# EAGLE design 5 to 3.3 Level Converter (EAGLE 7.5.0)
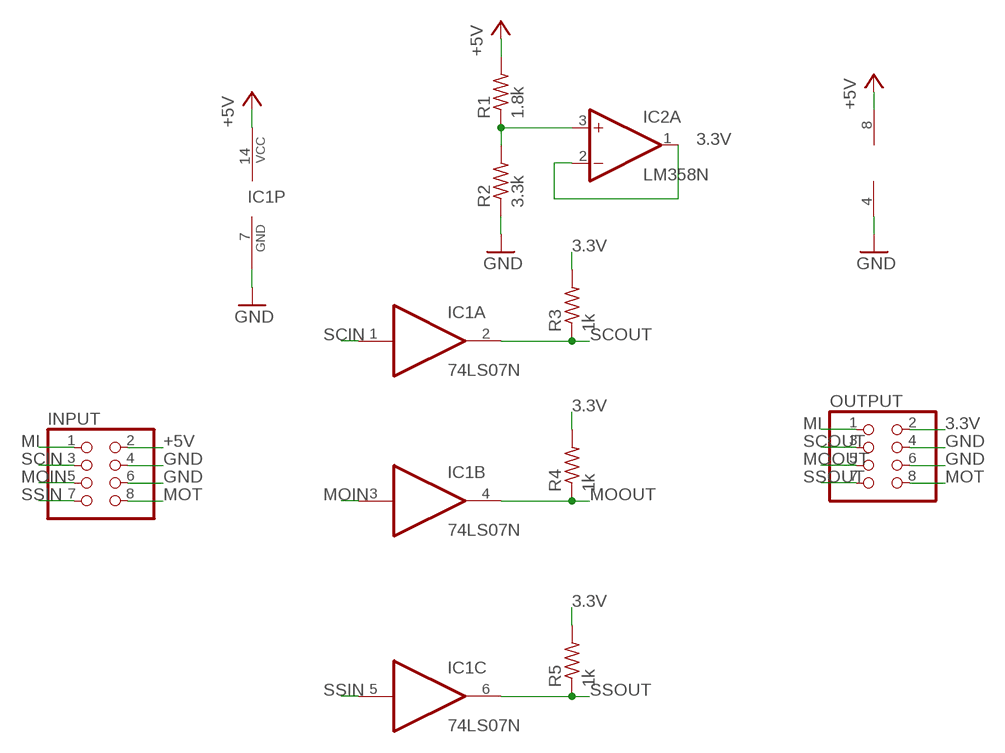
[diagram p0: schematic, sheet 1]

## Parts
IC1  74LS07N  [DIL14]
IC2  LM358N  [DIL08]
INPUT  PINHD-2X4  [2X04]
OUTPUT  PINHD-2X4  [2X04]
R1  1.8k  R-US_0207/7  [0207/7]
R2  3.3k  R-US_0207/7  [0207/7]
R3  1k  R-US_0207/7  [0207/7]
R4  1k  R-US_0207/7  [0207/7]
R5  1k  R-US_0207/7  [0207/7]

## Nets
3.3V: IC2.1(A:OUT) IC2.2(A:-IN) OUTPUT.2 R3.2 R4.2 R5.2
+5V: IC1.14(P:VCC) IC2.8(P:V+) INPUT.2 R1.2
GND: IC1.7(P:GND) IC2.4(P:V-) INPUT.4 INPUT.6 OUTPUT.4 OUTPUT.6 R2.1
MI: INPUT.1 OUTPUT.1
MOIN: IC1.3(B:I) INPUT.5
MOOUT: IC1.4(B:O) OUTPUT.5 R4.1
MOT: INPUT.8 OUTPUT.8
N$1: IC2.3(A:+IN) R1.1 R2.2
SCIN: IC1.1(A:I) INPUT.3
SCOUT: IC1.2(A:O) OUTPUT.3 R3.1
SSIN: IC1.5(C:I) INPUT.7
SSOUT: IC1.6(C:O) OUTPUT.7 R5.1
Unconnected: IC1.8(D:O) IC1.9(D:I) IC1.10(E:O) IC1.11(E:I) IC1.12(F:O) IC1.13(F:I) IC2.5(B:+IN) IC2.6(B:-IN) IC2.7(B:OUT)

## Library data of the parts
IC1 = 74xx-us:74*07: Hex BUFFER, open collector high-voltage output
IC2 = linear:LM358: OP AMP also LM158; LM258; LM2904 Source: http://cache.national.com/ds/LM/LM158.pdf
INPUT OUTPUT = pinhead:PINHD-2X4: PIN HEADER
R1-R5 = rcl:R-US_: RESISTOR, American symbol

## Board
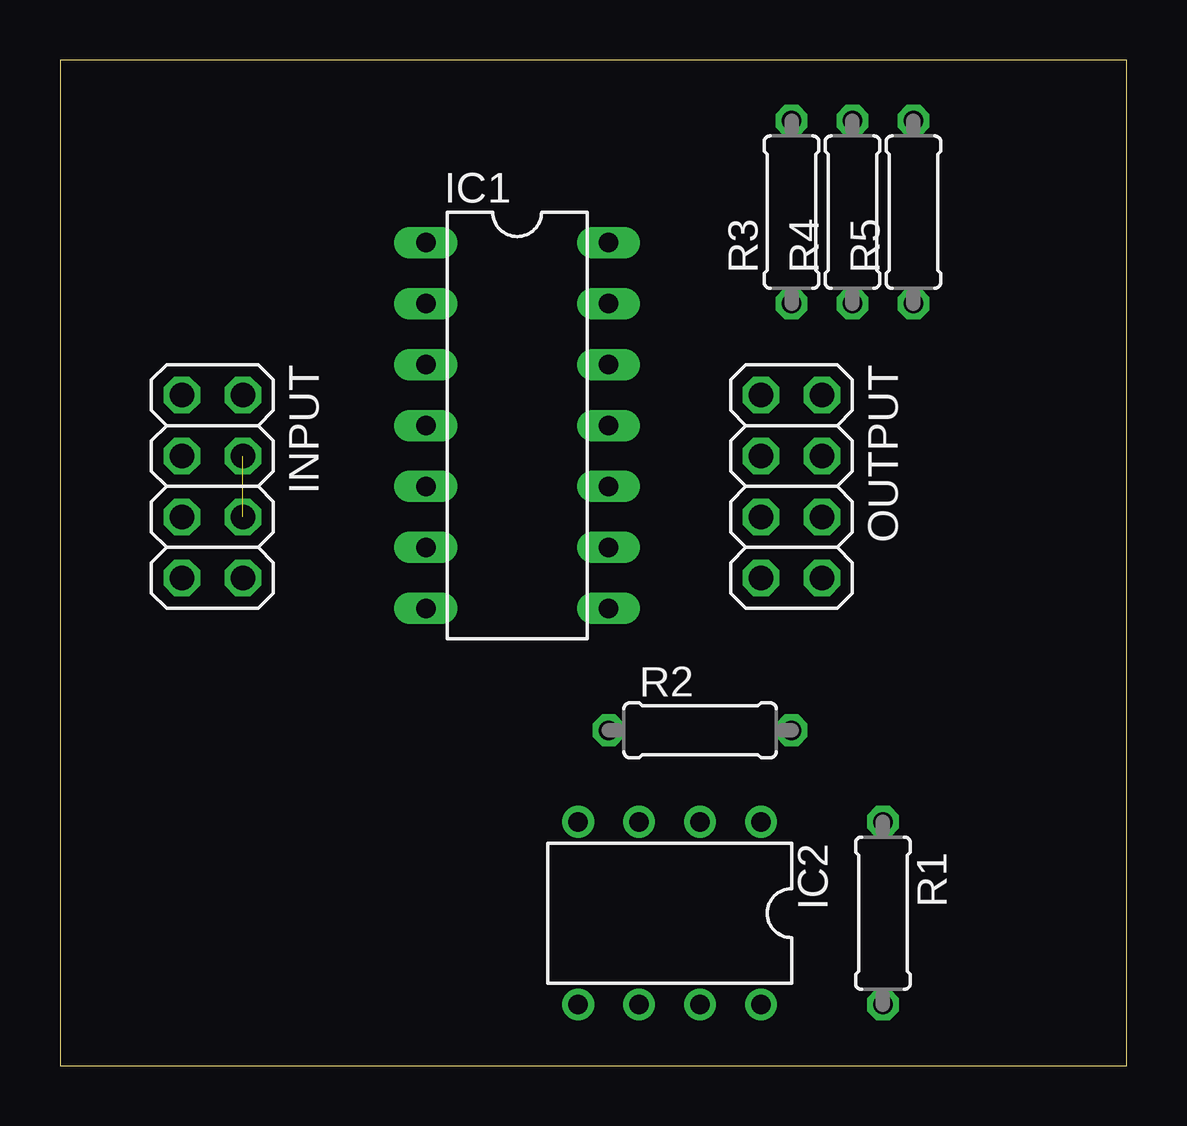
[diagram p1: board, top side]
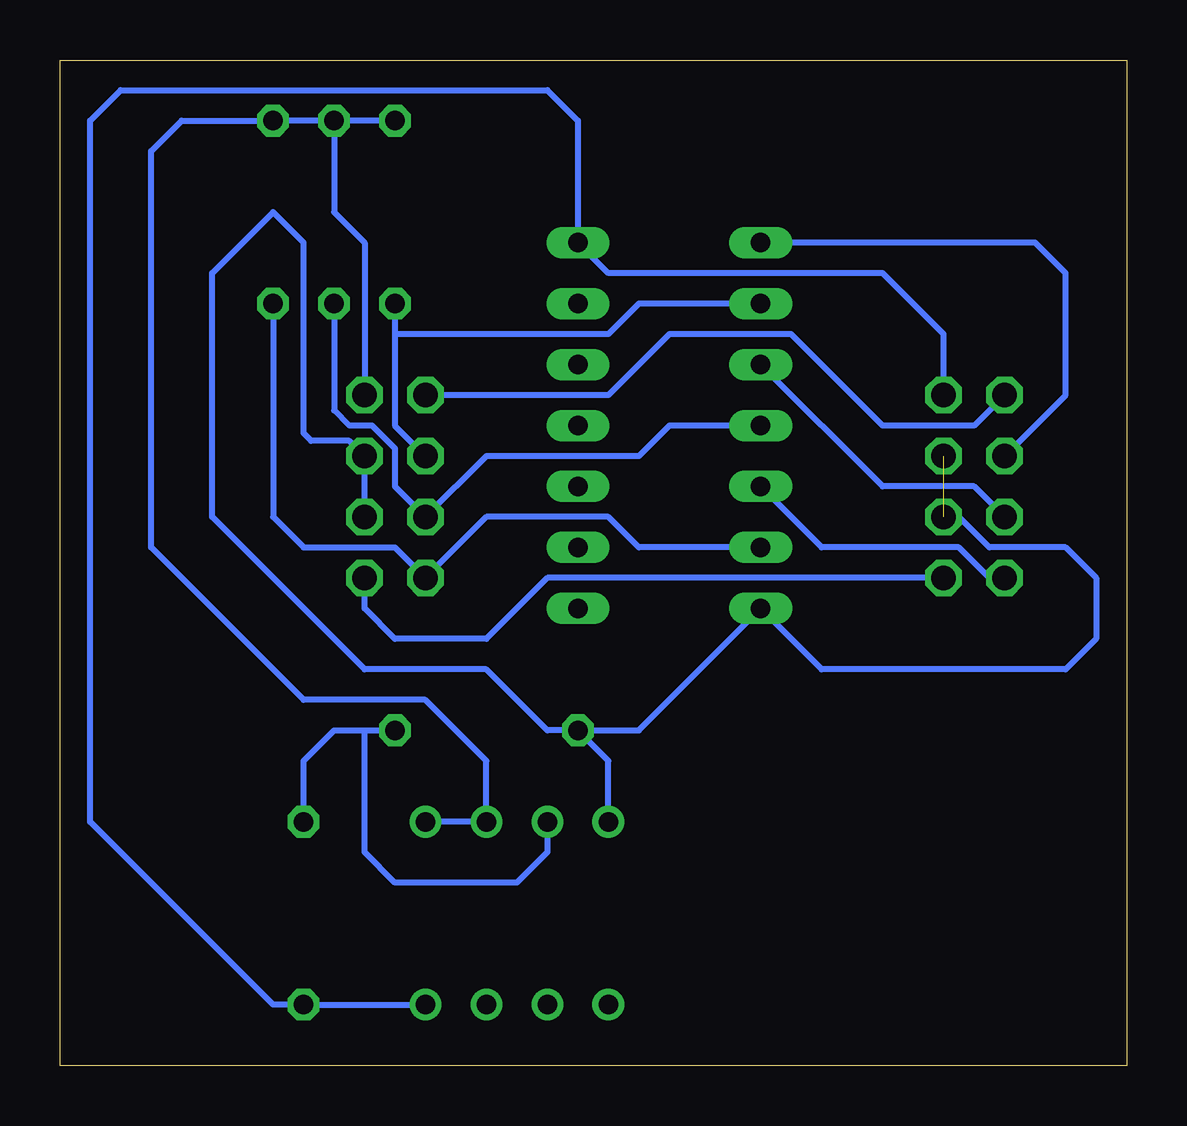
[diagram p2: board, bottom side, seen from below]

Size 44.44 x 41.9 mm. Coordinates in mm from the lower left corner, seen from the top.
Outline: 0,0 44.44,0 44.44,41.9 0,41.9 0,0
Copper layers (1*16): Top 0.035mm / dielectric 1.5mm / Bottom 0.035mm
Design rules "default": minimum track width 10mil, minimum drill 24mil, track to track 8mil, track to pad 8mil, pad to pad 8mil, via to via 8mil, smd to smd 8mil, copper to edge 40mil, drill to drill 8mil, minimum pad ring 10mil, minimum via ring 8mil, stop-mask expansion 4mil, vias tented up to drill 0mil, thermal gap 10mil

### Footprints (pad centres in the part's own frame; a part is rotated, then mirrored left to right if it is on the bottom)
DIL14 = drill 0.813 long: 1 -7.62,-3.81; 2 -5.08,-3.81; 3 -2.54,-3.81; 4 0,-3.81; 5 2.54,-3.81; 6 5.08,-3.81; 7 7.62,-3.81; 8 7.62,3.81; 9 5.08,3.81; 10 2.54,3.81; 11 0,3.81; 12 -2.54,3.81; 13 -5.08,3.81; 14 -7.62,3.81
DIL08 = drill 0.813 pad 1.27: 1 -3.81,-3.81; 2 -1.27,-3.81; 3 1.27,-3.81; 4 3.81,-3.81; 5 3.81,3.81; 6 1.27,3.81; 7 -1.27,3.81; 8 -3.81,3.81
2X04 = drill 1.016 octagon: 1 -3.81,-1.27; 2 -3.81,1.27; 3 -1.27,-1.27; 4 -1.27,1.27; 5 1.27,-1.27; 6 1.27,1.27; 7 3.81,-1.27; 8 3.81,1.27
0207/7 = drill 0.813 octagon: 1 -3.81,0; 2 3.81,0

### Placement (x,y rotation side)
IC1  19.05,26.67 270 top
IC2  25.4,6.35 180 top
INPUT  6.35,24.13 270 top
OUTPUT  30.48,24.13 270 top
R1  34.29,6.35 270 top
R2  26.67,13.97 0 top
R3  30.48,35.56 90 top
R4  33.02,35.56 90 top
R5  35.56,35.56 90 top

### Tracks (layer width: path | path; a pad name or v marks a point on that pad's centre or on a via)
3.3V
  Bottom 0.254: IC2.1 IC2.2 26.67,12.7 29.21,15.24 34.29,15.24 40.64,21.59 40.64,38.1 39.37,39.37 R5.2 R4.2 | R3.2 R4.2 | R4.2 33.02,35.56 31.75,34.29 OUTPUT.2
+5V
  Bottom 0.254: IC2.8 R1.2 35.56,2.54 43.18,10.16 43.18,39.37 41.91,40.64 24.13,40.64 22.86,39.37 IC1.14 21.59,33.02 10.16,33.02 7.62,30.48 INPUT.2
GND  (1 unrouted)
  Bottom 0.254: IC2.4 21.59,12.7 R2.1 | OUTPUT.6 OUTPUT.4 32.38,26.04 33.97,26.04 34.29,26.35 34.29,34.29 35.56,35.56 38.1,33.02 38.1,22.86 31.75,16.51 26.67,16.51 24.13,13.97 R2.1 | R2.1 20.32,13.97 IC1.7 12.7,16.51 2.54,16.51 1.27,17.78 1.27,20.32 2.54,21.59 5.71,21.59 6.99,22.86 INPUT.6
MI
  Bottom 0.254: INPUT.1 6.35,26.67 10.16,26.67 13.97,30.48 19.05,30.48 21.59,27.94 OUTPUT.1
MOIN
  Bottom 0.254: INPUT.5 6.35,24.13 10.16,24.13 IC1.3
MOOUT
  Bottom 0.254: R4.1 33.02,27.3 32.38,26.67 31.43,26.67 30.48,25.72 30.48,24.13 OUTPUT.5 26.67,25.4 20.32,25.4 19.05,26.67 IC1.4
MOT
  Bottom 0.254: INPUT.8 24.13,20.32 26.67,17.78 30.48,17.78 31.75,19.05 OUTPUT.8
N$1
  Bottom 0.254: R1.1 34.29,12.7 33.02,13.97 31.75,13.97 | 31.75,13.97 R2.2 | IC2.3 24.13,8.89 25.4,7.62 30.48,7.62 31.75,8.89 31.75,13.97
SCIN
  Bottom 0.254: INPUT.3 2.54,27.94 2.54,33.02 3.81,34.29 IC1.1
SCOUT
  Bottom 0.254: R3.1 30.48,30.48 | 30.48,30.48 30.48,26.67 OUTPUT.3 | IC1.2 20.32,31.75 21.59,30.48 30.48,30.48
SSIN
  Bottom 0.254: IC1.5 12.7,21.59 6.99,21.59 5.71,20.32 INPUT.7
SSOUT
  Bottom 0.254: R5.1 35.56,22.86 34.29,21.59 30.48,21.59 OUTPUT.7 26.67,22.86 21.59,22.86 20.32,21.59 IC1.6